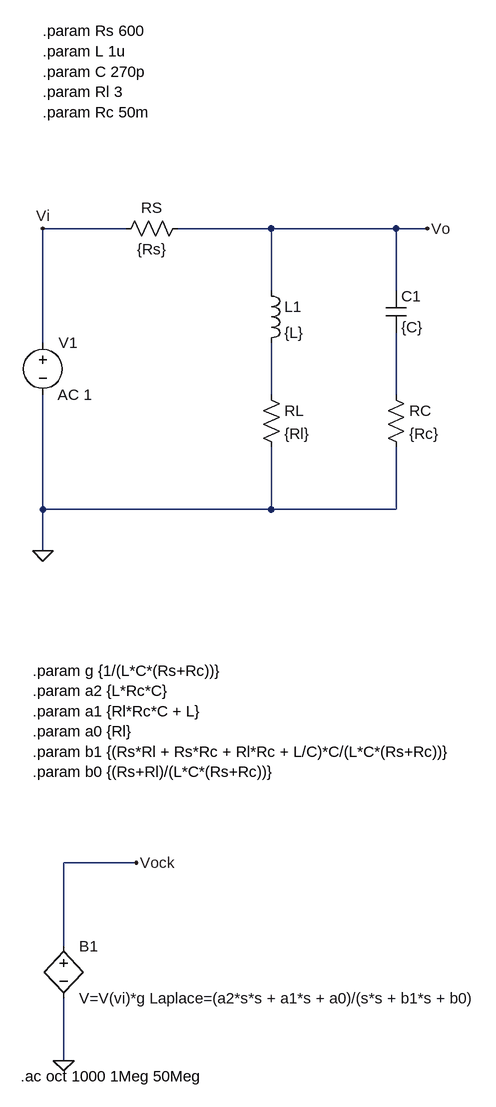
[diagram p0: schematic LRC_Transfer_Function_Verification.asc]
LRC_Transfer_Function_Verification.asc, the LTspice schematic file:
Version 4
SHEET 1 2200 4212
WIRE -208 -896 -336 -896
WIRE 16 -896 -128 -896
WIRE 208 -896 16 -896
WIRE 256 -896 208 -896
WIRE 16 -800 16 -896
WIRE 208 -800 208 -896
WIRE -336 -720 -336 -896
WIRE 16 -640 16 -720
WIRE 208 -640 208 -736
WIRE -336 -464 -336 -640
WIRE 16 -464 16 -560
WIRE 16 -464 -336 -464
WIRE 208 -464 208 -560
WIRE 208 -464 16 -464
WIRE -336 -400 -336 -464
WIRE -192 80 -304 80
WIRE -304 208 -304 80
WIRE -304 384 -304 288
FLAG 256 -896 Vo
FLAG -336 -896 Vi
FLAG -336 -400 0
FLAG -304 384 0
FLAG -192 80 Vock
SYMBOL ind 0 -816 R0
SYMATTR InstName L1
SYMATTR Value {L}
SYMBOL res 0 -656 R0
SYMATTR InstName RL
SYMATTR Value {Rl}
SYMBOL cap 192 -800 R0
SYMATTR InstName C1
SYMATTR Value {C}
SYMBOL res 192 -656 R0
SYMATTR InstName RC
SYMATTR Value {Rc}
SYMBOL res -112 -912 R90
WINDOW 0 0 56 VBottom 2
WINDOW 3 32 56 VTop 2
SYMATTR InstName RS
SYMATTR Value {Rs}
SYMBOL voltage -336 -736 R0
WINDOW 123 23 96 Left 2
WINDOW 39 0 0 Left 0
SYMATTR InstName V1
SYMATTR Value ""
SYMATTR Value2 AC 1
SYMBOL bv -304 192 R0
SYMATTR InstName B1
SYMATTR Value V=V(vi)*g Laplace=(a2*s*s + a1*s + a0)/(s*s + b1*s + b0)
TEXT -336 -1200 Left 2 !.param Rs 600\n.param L 1u\n.param C 270p\n.param Rl 3\n.param Rc 50m
TEXT -352 -216 Left 2 !.param g {1/(L*C*(Rs+Rc))}\n.param a2 {L*Rc*C}\n.param a1 {Rl*Rc*C + L}\n.param a0 {Rl}\n.param b1 {(Rs*Rl + Rs*Rc + Rl*Rc + L/C)*C/(L*C*(Rs+Rc))}\n.param b0 {(Rs+Rl)/(L*C*(Rs+Rc))}
TEXT -370 408 Left 2 !.ac oct 1000 1Meg 50Meg

The netlist it stands for:
* LRC_Transfer_Function_Verification.asc
L1 Vo N001 {L}
RL N001 0 {Rl}
C1 Vo N002 {C}
RC N002 0 {Rc}
RS Vo Vi {Rs}
V1 Vi 0 AC 1
B1 Vock 0 V=V(vi)*g Laplace=(a2*s*s + a1*s + a0)/(s*s + b1*s + b0)
.param Rs 600
.param L 1u
.param C 270p
.param Rl 3
.param Rc 50m
.param g {1/(L*C*(Rs+Rc))}
.param a2 {L*Rc*C}
.param a1 {Rl*Rc*C + L}
.param a0 {Rl}
.param b1 {(Rs*Rl + Rs*Rc + Rl*Rc + L/C)*C/(L*C*(Rs+Rc))}
.param b0 {(Rs+Rl)/(L*C*(Rs+Rc))}
.ac oct 1000 1Meg 50Meg
.backanno
.end